# Altium project MCH_CLKB.PrjPcb (part 2 of 2)

## Sheet CLKB_clocking_fpga.SchDoc
size A3
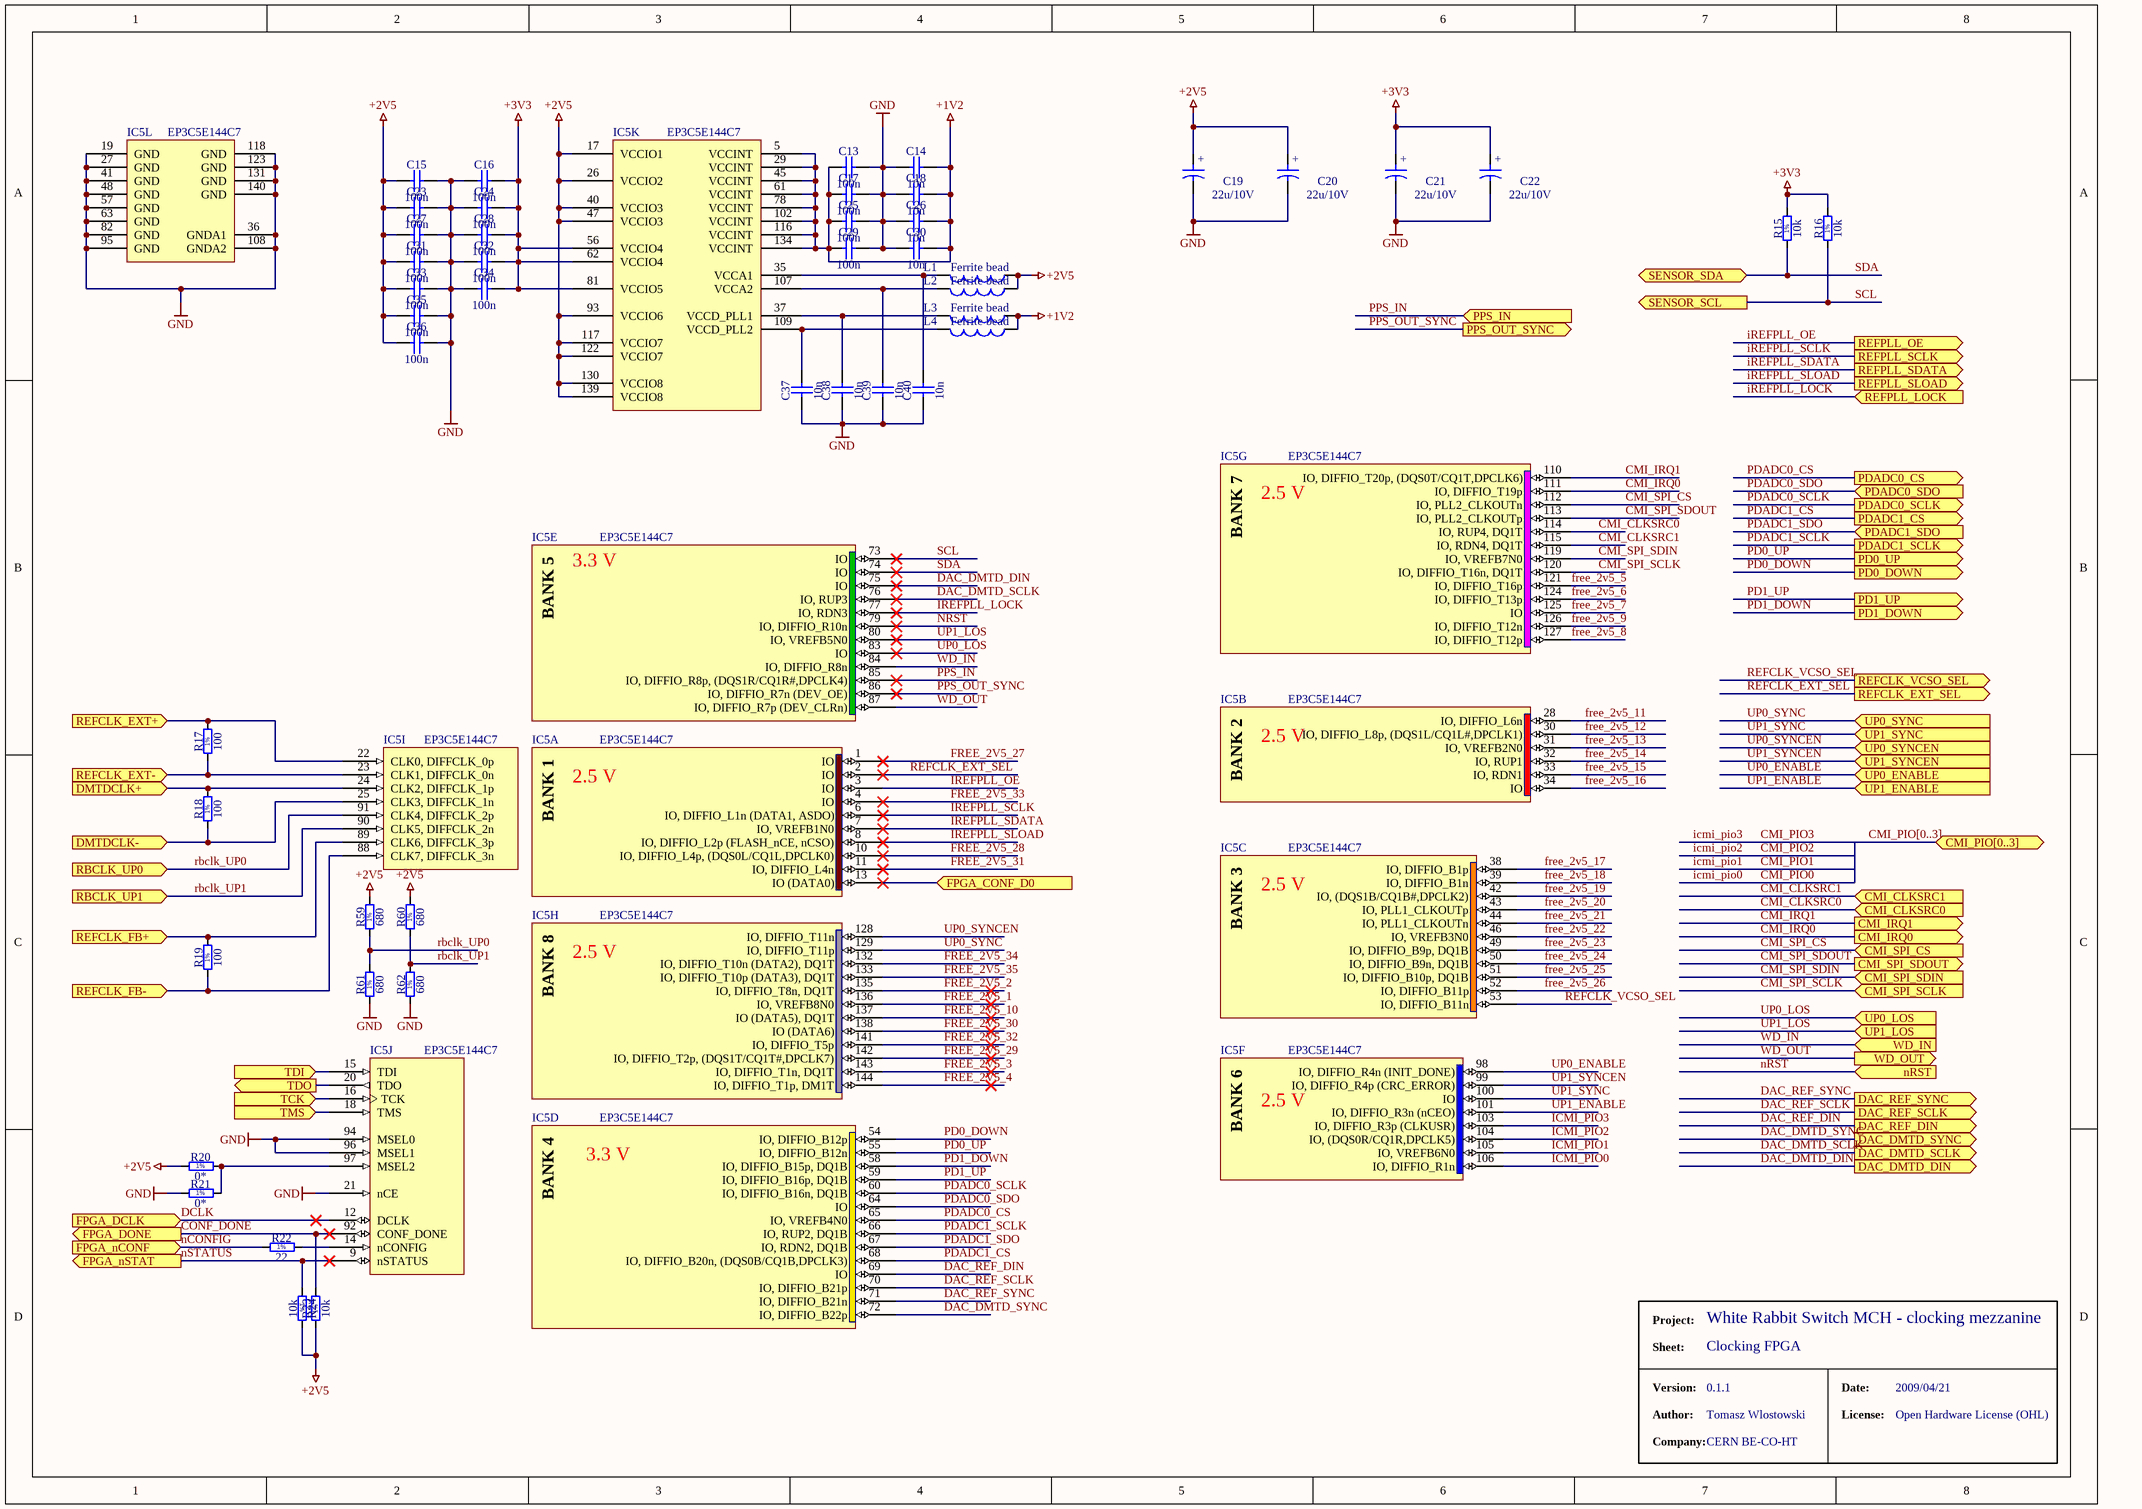
[diagram p4: CLKB_clocking_fpga.SchDoc]

### Parts
C13  100n  [CAPC1608X87N]
C14  10n  [CAPC1608X87N]
C15  100n  [CAPC1608X87N]
C16  100n  [CAPC1608X87N]
C17  100n  [CAPC1608X87N]
C18  10n  [CAPC1608X87N]
C19  22u/10V  [CAPMP3216X180N]
C20  22u/10V  [CAPMP3216X180N]
C21  22u/10V  [CAPMP3216X180N]
C22  22u/10V  [CAPMP3216X180N]
C23  100n  [CAPC1608X87N]
C24  100n  [CAPC1608X87N]
C25  100n  [CAPC1608X87N]
C26  10n  [CAPC1608X87N]
C27  100n  [CAPC1608X87N]
C28  100n  [CAPC1608X87N]
C29  100n  [CAPC1608X87N]
C30  10n  [CAPC1608X87N]
C31  100n  [CAPC1608X87N]
C32  100n  [CAPC1608X87N]
C33  100n  [CAPC1608X87N]
C34  100n  [CAPC1608X87N]
C35  100n  [CAPC1608X87N]
C36  100n  [CAPC1608X87N]
C37  10n  [CAPC1608X87N]
C38  10n  [CAPC1608X87N]
C39  10n  [CAPC1608X87N]
C40  10n  [CAPC1608X87N]
IC5  EP3C5E144C7  [EQFP144_N]  (parts A,B,C,D,E,F,G,H,I,J,K,L of 12)
L1  Ferrite bead  [L0603]
L2  Ferrite bead  [L0603]
L3  Ferrite bead  [L0603]
L4  Ferrite bead  [L0603]
R15  10k  [RESC1608X55N]
R16  10k  [RESC1608X55N]
R17  100  [RESC1608X55N]
R18  100  [RESC1608X55N]
R19  100  [RESC1608X55N]
R20  0*  [RESC1608X55N]
R21  0*  [RESC1608X55N]
R22  22  [RESC1608X55N]
R23  10k  [RESC1608X55N]
R24  10k  [RESC1608X55N]
R59  680  [RESC1608X55N]
R60  680  [RESC1608X55N]
R61  680  [RESC1608X55N]
R62  680  [RESC1608X55N]

### Ports
CMI_CLKSRC0 (in), CMI_CLKSRC1 (in), CMI_IRQ0 (out), CMI_IRQ1 (out), CMI_PIO[0..3] (bidir), CMI_SPI_CS (in), CMI_SPI_SCLK (in), CMI_SPI_SDIN (in), CMI_SPI_SDOUT (out), DAC_DMTD_DIN (out), DAC_DMTD_SCLK (out), DAC_DMTD_SYNC (out), DAC_REF_DIN (out), DAC_REF_SCLK (out), DAC_REF_SYNC (out), DMTDCLK+ (in), DMTDCLK- (in), FPGA_CONF_D0 (in), FPGA_DCLK (in), FPGA_DONE (out), FPGA_nCONF (in), FPGA_nSTAT (out), nRST (in), PD0_DOWN (out), PD0_UP (out), PD1_DOWN (out), PD1_UP (out), PDADC0_CS (out), PDADC0_SCLK (out), PDADC0_SDO (in), PDADC1_CS (out), PDADC1_SCLK (out), PDADC1_SDO (in), PPS_IN (in), PPS_OUT_SYNC (out), RBCLK_UP0 (in), RBCLK_UP1 (in), REFCLK_EXT+ (in), REFCLK_EXT- (in), REFCLK_EXT_SEL (out), REFCLK_FB+ (in), REFCLK_FB- (in), REFCLK_VCSO_SEL (out), REFPLL_LOCK (in), REFPLL_OE (out), REFPLL_SCLK (out), REFPLL_SDATA (out), REFPLL_SLOAD (out), SENSOR_SCL (out), SENSOR_SDA (bidir), TCK (in), TDI (in), TDO (out), TMS (in), UP0_ENABLE (in), UP0_LOS (in), UP0_SYNC (in), UP0_SYNCEN (in), UP1_ENABLE (in), UP1_LOS (in), UP1_SYNC (in), UP1_SYNCEN (in), WD_IN (in), WD_OUT (out)

### Nets
+1V2: C13.1 C14.2 C17.1 C18.2 C25.1 C26.2 C29.1 C30.2 IC5.5(VCCINT) IC5.29(VCCINT) IC5.45(VCCINT) IC5.61(VCCINT) IC5.78(VCCINT) IC5.102(VCCINT) IC5.116(VCCINT) IC5.134(VCCINT) L3.1 L4.1
+2V5: C15.1 C19.1 C20.1 C23.1 C27.1 C31.1 C33.1 C35.1 C36.1 IC5.17(VCCIO1) IC5.26(VCCIO2) IC5.40(VCCIO3) IC5.47(VCCIO3) IC5.93(VCCIO6) IC5.117(VCCIO7) IC5.122(VCCIO7) IC5.130(VCCIO8) IC5.139(VCCIO8) L1.1 L2.1 R20.1 R23.1 R24.2 R59.2 R60.2
+3V3: C16.2 C21.1 C22.1 C24.2 C28.2 C32.2 C34.2 IC5.56(VCCIO4) IC5.62(VCCIO4) IC5.81(VCCIO5) R15.2 R16.2
GND: C13.2 C14.1 C15.2 C16.1 C17.2 C18.1 C19.2 C20.2 C21.2 C22.2 C23.2 C24.1 C25.2 C26.1 C27.2 C28.1 C29.2 C30.1 C31.2 C32.1 C33.2 C34.1 C35.2 C36.2 C37.1 C38.1 C39.1 C40.1 IC5.19(GND) IC5.21(nCE) IC5.27(GND) IC5.36(GNDA1) IC5.41(GND) IC5.48(GND) IC5.57(GND) IC5.63(GND) IC5.82(GND) IC5.94(MSEL0) IC5.95(GND) IC5.96(MSEL1) IC5.108(GNDA2) IC5.118(GND) IC5.123(GND) IC5.131(GND) IC5.140(GND) R21.1 R61.1 R62.1
CMI_CLKSRC0: IC5.114(IO,_RUP4,_DQ1T) ; port CMI_CLKSRC0
CMI_CLKSRC1: IC5.115(IO,_RDN4,_DQ1T) ; port CMI_CLKSRC1
CMI_IRQ0: IC5.111(IO,_DIFFIO_T19p) ; port CMI_IRQ0
CMI_IRQ1: IC5.110(IO,_DIFFIO_T20p,_(DQS0T/CQ1T,DPCLK6)) ; port CMI_IRQ1
CMI_PIO0: IC5.106(IO,_DIFFIO_R1n)  [also labelled icmi_pio0]
CMI_PIO1: IC5.105(IO,_VREFB6N0)  [also labelled icmi_pio1]
CMI_PIO2: IC5.104(IO,_(DQS0R/CQ1R,DPCLK5))  [also labelled icmi_pio2]
CMI_PIO3: IC5.103(IO,_DIFFIO_R3p_(CLKUSR))  [also labelled icmi_pio3]
CMI_SPI_CS: IC5.112(IO,_PLL2_CLKOUTn) ; port CMI_SPI_CS
CMI_SPI_SCLK: IC5.120(IO,_DIFFIO_T16n,_DQ1T) ; port CMI_SPI_SCLK
CMI_SPI_SDIN: IC5.119(IO,_VREFB7N0) ; port CMI_SPI_SDIN
CMI_SPI_SDOUT: IC5.113(IO,_PLL2_CLKOUTp) ; port CMI_SPI_SDOUT
CONF_DONE: IC5.92(CONF_DONE) R23.2 ; port FPGA_DONE  [project net FPGA_DONE]
DAC_DMTD_DIN: IC5.75(IO) ; port DAC_DMTD_DIN
DAC_DMTD_SCLK: IC5.76(IO,_RUP3) ; port DAC_DMTD_SCLK
DAC_DMTD_SYNC: IC5.72(IO,_DIFFIO_B22p) ; port DAC_DMTD_SYNC
DAC_REF_DIN: IC5.69(IO) ; port DAC_REF_DIN
DAC_REF_SCLK: IC5.70(IO,_DIFFIO_B21p) ; port DAC_REF_SCLK
DAC_REF_SYNC: IC5.71(IO,_DIFFIO_B21n) ; port DAC_REF_SYNC
DCLK: IC5.12(DCLK) ; port FPGA_DCLK  [project net FPGA_DCLK]
DMTDCLK+: IC5.24(CLK2,_DIFFCLK_1p) R18.2 ; port DMTDCLK+
DMTDCLK-: IC5.25(CLK3,_DIFFCLK_1n) R18.1 ; port DMTDCLK-
FPGA_CONF_D0: IC5.13(IO_(DATA0)) ; port FPGA_CONF_D0
FREE_2V5_1: IC5.136(IO,_VREFB8N0)
FREE_2V5_2: IC5.135(IO,_DIFFIO_T8n,_DQ1T)
FREE_2V5_3: IC5.143(IO,_DIFFIO_T1n,_DQ1T)
FREE_2V5_4: IC5.144(IO,_DIFFIO_T1p,_DM1T)
free_2v5_5: IC5.121(IO,_DIFFIO_T16p)
free_2v5_6: IC5.124(IO,_DIFFIO_T13p)
free_2v5_7: IC5.125(IO)
free_2v5_8: IC5.127(IO,_DIFFIO_T12p)
free_2v5_9: IC5.126(IO,_DIFFIO_T12n)
FREE_2V5_10: IC5.137(IO_(DATA5),_DQ1T)
free_2v5_11: IC5.28(IO,_DIFFIO_L6n)
free_2v5_12: IC5.30(IO,_DIFFIO_L8p,_(DQS1L/CQ1L#,DPCLK1))
free_2v5_13: IC5.31(IO,_VREFB2N0)
free_2v5_14: IC5.32(IO,_RUP1)
free_2v5_15: IC5.33(IO,_RDN1)
free_2v5_16: IC5.34(IO)
free_2v5_17: IC5.38(IO,_DIFFIO_B1p)
free_2v5_18: IC5.39(IO,_DIFFIO_B1n)
free_2v5_19: IC5.42(IO,_(DQS1B/CQ1B#,DPCLK2))
free_2v5_20: IC5.43(IO,_PLL1_CLKOUTp)
free_2v5_21: IC5.44(IO,_PLL1_CLKOUTn)
free_2v5_22: IC5.46(IO,_VREFB3N0)
free_2v5_23: IC5.49(IO,_DIFFIO_B9p,_DQ1B)
free_2v5_24: IC5.50(IO,_DIFFIO_B9n,_DQ1B)
free_2v5_25: IC5.51(IO,_DIFFIO_B10p,_DQ1B)
free_2v5_26: IC5.52(IO,_DIFFIO_B11p)
FREE_2V5_27: IC5.1(IO)
FREE_2V5_28: IC5.10(IO,_DIFFIO_L4p,_(DQS0L/CQ1L,DPCLK0))
FREE_2V5_29: IC5.142(IO,_DIFFIO_T2p,_(DQS1T/CQ1T#,DPCLK7))
FREE_2V5_30: IC5.138(IO_(DATA6))
FREE_2V5_31: IC5.11(IO,_DIFFIO_L4n)
FREE_2V5_32: IC5.141(IO,_DIFFIO_T5p)
FREE_2V5_33: IC5.4(IO)
FREE_2V5_34: IC5.132(IO,_DIFFIO_T10n_(DATA2),_DQ1T)
FREE_2V5_35: IC5.133(IO,_DIFFIO_T10p_(DATA3),_DQ1T)
iREFPLL_LOCK: IC5.77(IO,_RDN3) ; port REFPLL_LOCK  [project net EXTPLL_LOCK]
iREFPLL_OE: IC5.3(IO) ; port REFPLL_OE  [project net EXTPLL_OE]
iREFPLL_SCLK: IC5.6(IO,_DIFFIO_L1n_(DATA1,_ASDO)) ; port REFPLL_SCLK  [project net EXTPLL_SCLK]
iREFPLL_SDATA: IC5.7(IO,_VREFB1N0) ; port REFPLL_SDATA  [project net EXTPLL_SDATA]
iREFPLL_SLOAD: IC5.8(IO,_DIFFIO_L2p_(FLASH_nCE,_nCSO)) ; port REFPLL_SLOAD  [project net EXTPLL_SLOAD]
JTAG_TCK: IC5.16(TCK) ; port TCK
JTAG_TDI: IC5.15(TDI) ; port TDI
JTAG_TMS: IC5.18(TMS) ; port TMS
nCONFIG: R22.1 ; port FPGA_nCONF  [project net FPGA_nCONF]
nRST: IC5.79(IO,_DIFFIO_R10n) ; port nRST
nSTATUS: IC5.9(nSTATUS) R24.1 ; port FPGA_nSTAT  [project net FPGA_nSTAT]
PD0_DOWN: IC5.54(IO,_DIFFIO_B12p) ; port PD0_DOWN
PD0_UP: IC5.55(IO,_DIFFIO_B12n) ; port PD0_UP
PD1_DOWN: IC5.58(IO,_DIFFIO_B15p,_DQ1B) ; port PD1_DOWN
PD1_UP: IC5.59(IO,_DIFFIO_B16p,_DQ1B) ; port PD1_UP
PDADC0_CS: IC5.65(IO,_VREFB4N0) ; port PDADC0_CS
PDADC0_SCLK: IC5.60(IO,_DIFFIO_B16n,_DQ1B) ; port PDADC0_SCLK
PDADC0_SDO: IC5.64(IO) ; port PDADC0_SDO
PDADC1_CS: IC5.68(IO,_DIFFIO_B20n,_(DQS0B/CQ1B,DPCLK3)) ; port PDADC1_CS
PDADC1_SCLK: IC5.66(IO,_RUP2,_DQ1B) ; port PDADC1_SCLK
PDADC1_SDO: IC5.67(IO,_RDN2,_DQ1B) ; port PDADC1_SDO
PPS_IN: IC5.85(IO,_DIFFIO_R8p,_(DQS1R/CQ1R#,DPCLK4)) ; port PPS_IN  [project net PPS_IN_EXT]
PPS_OUT_SYNC: IC5.86(IO,_DIFFIO_R7n_(DEV_OE)) ; port PPS_OUT_SYNC
rbclk_UP0: IC5.91(CLK4,_DIFFCLK_2p) R59.1 R61.2 ; port RBCLK_UP0  [project net UP0_RBCLK]
rbclk_UP1: IC5.90(CLK5,_DIFFCLK_2n) R60.1 R62.2 ; port RBCLK_UP1  [project net UP1_RBCLK]
REFCLK_EXT_FB+: IC5.22(CLK0,_DIFFCLK_0p) R17.2 ; port REFCLK_EXT+
REFCLK_EXT_FB-: IC5.23(CLK1,_DIFFCLK_0n) R17.1 ; port REFCLK_EXT-
REFCLK_EXT_SEL: IC5.2(IO) ; port REFCLK_EXT_SEL
REFCLK_FB+: IC5.88(CLK7,_DIFFCLK_3n) R19.1 ; port REFCLK_FB-
REFCLK_FB-: IC5.89(CLK6,_DIFFCLK_3p) R19.2 ; port REFCLK_FB+
REFCLK_VCSO_SEL: IC5.53(IO,_DIFFIO_B11n) ; port REFCLK_VCSO_SEL
SCL: IC5.73(IO) R16.1 ; port SENSOR_SCL
SDA: IC5.74(IO) R15.1 ; port SENSOR_SDA
TDO: IC5.20(TDO) ; port TDO
UP0_ENABLE: IC5.98(IO,_DIFFIO_R4n_(INIT_DONE)) ; port UP0_ENABLE
UP0_LOS: IC5.83(IO) ; port UP0_LOS
UP0_SYNC: IC5.129(IO,_DIFFIO_T11p) ; port UP0_SYNC
UP0_SYNCEN: IC5.128(IO,_DIFFIO_T11n) ; port UP0_SYNCEN
UP1_ENABLE: IC5.101(IO,_DIFFIO_R3n_(nCEO)) ; port UP1_ENABLE
UP1_LOS: IC5.80(IO,_VREFB5N0) ; port UP1_LOS
UP1_SYNC: IC5.100(IO) ; port UP1_SYNC
UP1_SYNCEN: IC5.99(IO,_DIFFIO_R4p_(CRC_ERROR)) ; port UP1_SYNCEN
WD_IN: IC5.84(IO,_DIFFIO_R8n) ; port WD_IN
WD_OUT: IC5.87(IO,_DIFFIO_R7p_(DEV_CLRn)) ; port WD_OUT
NetC37_2: C37.2 IC5.109(VCCD_PLL2) L4.2
NetC38_2: C38.2 IC5.37(VCCD_PLL1) L3.2
NetC39_2: C39.2 IC5.107(VCCA2) L2.2
NetC40_2: C40.2 IC5.35(VCCA1) L1.2
NetIC5_14: IC5.14(nCONFIG) R22.2
NetIC5_97: IC5.97(MSEL2) R20.2 R21.2

### Buses and harness runs
bus CMI_PIO[0..3] = port CMI_PIO[0..3]

### Notes on the sheet
- 2.5 V
- 3.3 V
- Project:
- White Rabbit Switch MCH - clocking mezzanine
- Sheet:
- Version:
- Clocking FPGA
- 0.1.1
- Date:
- 2009/04/21
- Author:
- Company:
- Tomasz Wlostowski
- CERN BE-CO-HT
- License:
- Open Hardware License (OHL)
- (in symbol CTE3216-18_22UF_10V_10%) +
- (in symbol EP3C5E144C7, part A) BANK 1
- (in symbol EP3C5E144C7, part B) BANK 2
- (in symbol EP3C5E144C7, part C) BANK 3
- (in symbol EP3C5E144C7, part D) BANK 4
- (in symbol EP3C5E144C7, part E) BANK 5
- (in symbol EP3C5E144C7, part F) BANK 6
- (in symbol EP3C5E144C7, part G) BANK 7
- (in symbol EP3C5E144C7, part H) BANK 8
- (in symbol R0603_0R_JUMPER) 1%
- (in symbol R0603_10K_1%_0.1W_100PPM) 1%
- (in symbol R0603_22R_1%_0.1W_100PPM) 1%
- (in symbol R0603_100R_1%_0.1W_100PPM) 1%
- (in symbol R0603_680R_1%_0.1W_100PPM) 1%

### Library data of the parts
C13 C15-C17 C23-C25 C27-C29 C31-C36 = CC0603_100NF_50V_10%_X7R: Non-polarised capacitor; Part Description: SMD Multilayer Chip Ceramic Capacitor; Manufacturer: GENERIC; Manufacturer1 Part Number: 223858615649; Manufacturer1 Datasheet: \\cern.ch\dfs\Applications\Altium\Datasheets\CC0603_X7R_PHYCOMP.pdf; Value: 100nF; Voltage: 50V; TC: X7R; Tolerance: ±10%; Table: Capacitors SMD; Part Number: CC0603_100NF_50V_10%_X7R; Component Kind: Standard; Component Type: Standard; Designator: Capacitor - non polarized; Library Reference: Capacitor - non polarized; Pin Count: 2; Status: Preferred; Manufacturer Part Number: CC0603_100NF_50V_10%_X7R; Case: 0603; Mounted: Yes; Socket: No; SMD: Yes; Manufacturer1 Example: PHYCOMP; Manufacturer1 ComponentHeight: 0.87mm; HelpURL: \\cern.ch\dfs\Applications\Altium\Datasheets\CC0603_X7R_PHYCOMP.pdf; Author: CERN DEM JLC; CreateDate: 12/3/2007; LatestRevisionDate: 12/3/2007
C14 C18 C26 C30 C37-C40 = CC0603_10NF_50V_10%_X7R: Non-polarised capacitor; Part Description: SMD Multilayer Chip Ceramic Capacitor; Manufacturer: GENERIC; Manufacturer1 Part Number: 223858615636; Manufacturer1 Datasheet: \\cern.ch\dfs\Applications\Altium\Datasheets\CC0603_X7R_PHYCOMP.pdf; Value: 10nF; Voltage: 50V; TC: X7R; Tolerance: ±10%; Table: Capacitors SMD; Part Number: CC0603_10NF_50V_10%_X7R; Component Kind: Standard; Component Type: Standard; Designator: Capacitor - non polarized; Library Reference: Capacitor - non polarized; Pin Count: 2; Status: Preferred; Manufacturer Part Number: CC0603_10NF_50V_10%_X7R; Case: 0603; Mounted: Yes; Socket: No; SMD: Yes; Manufacturer1 Example: PHYCOMP; Manufacturer1 ComponentHeight: 0.87mm; HelpURL: \\cern.ch\dfs\Applications\Altium\Datasheets\CC0603_X7R_PHYCOMP.pdf; Author: CERN DEM JLC; CreateDate: 12/3/2007; LatestRevisionDate: 12/3/2007
C19-C22 = CTE3216-18_22UF_10V_10%: Polarised capacitor; Part Description: Solid Tantalum Chip Capacitor; Manufacturer: GENERIC; Manufacturer1 Part Number: TAJA226K010R; Manufacturer1 Datasheet: \\cern.ch\dfs\Applications\Altium\Datasheets\CTE_AVX_TAJ.pdf; Value: 22uF; Voltage: 10V; Tolerance: ±10%; Table: Capacitors SMD; Part Number: CTE3216-18_22UF_10V_10%; Component Kind: Standard; Component Type: Standard; Designator: Capacitor - polarized; Library Reference: Capacitor - polarized; Pin Count: 2; Status: Preferred; Manufacturer Part Number: CTE3216-18_22UF_10V_10%; Case: A; Mounted: Yes; Socket: No; SMD: Yes; Manufacturer1 Example: AVX; Manufacturer1 ComponentHeight: 1.8mm; HelpURL: \\cern.ch\dfs\Applications\Altium\Datasheets\CTE_AVX_TAJ.pdf; Author: CERN DEM JLC; CreateDate: 12/3/2007; LatestRevisionDate: 12/3/2007
IC5 = EP3C5E144C7: Cyclone III Family FPGA, 94 I/O Pins, 4 PLLs, 144-Pin EQFP, Speed Grade 7, Commercial Grade; Note: Exposed pad at the bottom of this package must be connected to PCB GND.; RefId: 1635055; Published: 14-Mar-2008; DatasheetVersion: ver1.2, Sep-2007; PackageVersion: ver14.8, Oct-2007; PackageReference: EQFP144; Publisher: Altium Limited; PackageDescription: 144-Pin Plastic Enhanced Quad Flat Pack (EQFP144) - Wire Bond; Code_JEDEC: MS-026-BFB; ComponentLink1Description: Manufacturer Link; ComponentLink1URL: http://www.altera.com/; ComponentLink2Description: Handbook (7.86MB); ComponentLink2URL: http://www.altera.com/literature/hb/cyc3/cyclone3_handbook.pdf; ComponentLink3Description: Packaging Specification; ComponentLink3URL: http://www.altera.com/literature/ds/dspkg.pdf; Supplier: Farnell
L1-L4 = Inductor: Code_IEC: 1005; Published: 8-Jun-2000; LatestRevisionDate: 17-Jul-2002; LatestRevisionNote: Re-released for DXP Platform.; PackageReference: 0402-A; Publisher: Altium Limited; Code_JEITA: 0402
R15 R16 R23 R24 = R0603_10K_1%_0.1W_100PPM: Resistor - 1%; Part Description: General Purpose Thick Film Chip Resistor; Manufacturer: GENERIC; Manufacturer1 Part Number: NRC06F1002TRF; Manufacturer1 Datasheet: \\cern.ch\dfs\Applications\Altium\Datasheets\R0603_NIC_NRC.pdf; Power: 0.1W; TC: ±100ppm/°C; Table: Resistors SMD; Part Number: R0603_10K_1%_0.1W_100PPM; Component Kind: Standard; Component Type: Standard; Designator: Resistor - 1%; Library Reference: Resistor - 1%; Pin Count: 2; Value: 10k; Status: Preferred; Tolerance: ±1%; Manufacturer Part Number: R0603_10K_1%_0.1W_100PPM; Case: 0603; Mounted: Yes; Socket: No; SMD: Yes; Manufacturer1 Example: NIC COMPONENT; Manufacturer1 ComponentHeight: 0.55mm; HelpURL: \\cern.ch\dfs\Applications\Altium\Datasheets\R0603_NIC_NRC.pdf; Author: CERN DEM JLC; CreateDate: 12/3/2007; LatestRevisionDate: 3/13/2008
R17-R19 = R0603_100R_1%_0.1W_100PPM: Resistor - 1%; Part Description: General Purpose Thick Film Chip Resistor; Manufacturer: GENERIC; Manufacturer1 Part Number: NRC06F4700TRF; Manufacturer1 Datasheet: \\cern.ch\dfs\Applications\Altium\Datasheets\R0603_NIC_NRC.pdf; Power: 0.1W; TC: ±100ppm/°C; Table: Resistors SMD; Part Number: R0603_100R_1%_0.1W_100PPM; Component Kind: Standard; Component Type: Standard; Designator: Resistor - 1%; Library Reference: Resistor - 1%; Pin Count: 2; Value: 100; Status: Preferred; Tolerance: ±1%; Manufacturer Part Number: R0603_100R_1%_0.1W_100PPM; Case: 0603; Mounted: Yes; Socket: No; SMD: Yes; Manufacturer1 Example: NIC COMPONENT; Manufacturer1 ComponentHeight: 0.55mm; HelpURL: \\cern.ch\dfs\Applications\Altium\Datasheets\R0603_NIC_NRC.pdf; Author: CERN DEM JLC; CreateDate: 12/3/2007; LatestRevisionDate: 3/13/2008
R20 R21 = R0603_0R_JUMPER: Resistor - 1%; Part Description: 1A (0.05R Max DC Resistance) Zero Ohm Jumper; Manufacturer: GENERIC; Manufacturer1 Part Number: NRC06Z0; Manufacturer1 Datasheet: \\cern.ch\dfs\Applications\Altium\Datasheets\R0603_NIC_NRC.pdf; Value: 0; Table: Resistors SMD; Part Number: R0603_0R_JUMPER; Component Kind: Standard; Component Type: Standard; Designator: Resistor - 1%; Library Reference: Resistor - 1%; Pin Count: 2; Status: Preferred; Manufacturer Part Number: R0603_0R_JUMPER; Case: 0603; Mounted: Yes; Socket: No; SMD: Yes; Manufacturer1 Example: NIC COMPONENT; Manufacturer1 ComponentHeight: 0.55mm; HelpURL: \\cern.ch\dfs\Applications\Altium\Datasheets\R0603_NIC_NRC.pdf; Author: CERN DEM JLC; CreateDate: 12/3/2007; LatestRevisionDate: 3/13/2008
R22 = R0603_22R_1%_0.1W_100PPM: Resistor - 1%; Part Description: General Purpose Thick Film Chip Resistor; Manufacturer: GENERIC; Manufacturer1 Part Number: NRC06F22R0TRF; Manufacturer1 Datasheet: \\cern.ch\dfs\Applications\Altium\Datasheets\R0603_NIC_NRC.pdf; Power: 0.1W; TC: ±100ppm/°C; Table: Resistors SMD; Part Number: R0603_22R_1%_0.1W_100PPM; Component Kind: Standard; Component Type: Standard; Designator: Resistor - 1%; Library Reference: Resistor - 1%; Pin Count: 2; Value: 22; Status: Preferred; Tolerance: ±1%; Manufacturer Part Number: R0603_22R_1%_0.1W_100PPM; Case: 0603; Mounted: Yes; Socket: No; SMD: Yes; Manufacturer1 Example: NIC COMPONENT; Manufacturer1 ComponentHeight: 0.55mm; HelpURL: \\cern.ch\dfs\Applications\Altium\Datasheets\R0603_NIC_NRC.pdf; Author: CERN DEM JLC; CreateDate: 12/3/2007; LatestRevisionDate: 3/13/2008
R59-R62 = R0603_680R_1%_0.1W_100PPM: Resistor - 1%; Part Description: General Purpose Thick Film Chip Resistor; Manufacturer: GENERIC; Manufacturer1 Part Number: NRC06F6800TRF; Manufacturer1 Datasheet: \\cern.ch\dfs\Applications\Altium\Datasheets\R0603_NIC_NRC.pdf; Power: 0.1W; TC: ±100ppm/°C; Table: Resistors SMD; Part Number: R0603_680R_1%_0.1W_100PPM; Component Kind: Standard; Component Type: Standard; Designator: Resistor - 1%; Library Reference: Resistor - 1%; Pin Count: 2; Value: 680; Status: Preferred; Tolerance: ±1%; Manufacturer Part Number: R0603_680R_1%_0.1W_100PPM; Case: 0603; Mounted: Yes; Socket: No; SMD: Yes; Manufacturer1 Example: NIC COMPONENT; Manufacturer1 ComponentHeight: 0.55mm; HelpURL: \\cern.ch\dfs\Applications\Altium\Datasheets\R0603_NIC_NRC.pdf; Author: CERN DEM JLC; CreateDate: 12/3/2007; LatestRevisionDate: 3/13/2008

## Sheet CLKB_RS232_port.SchDoc
size A
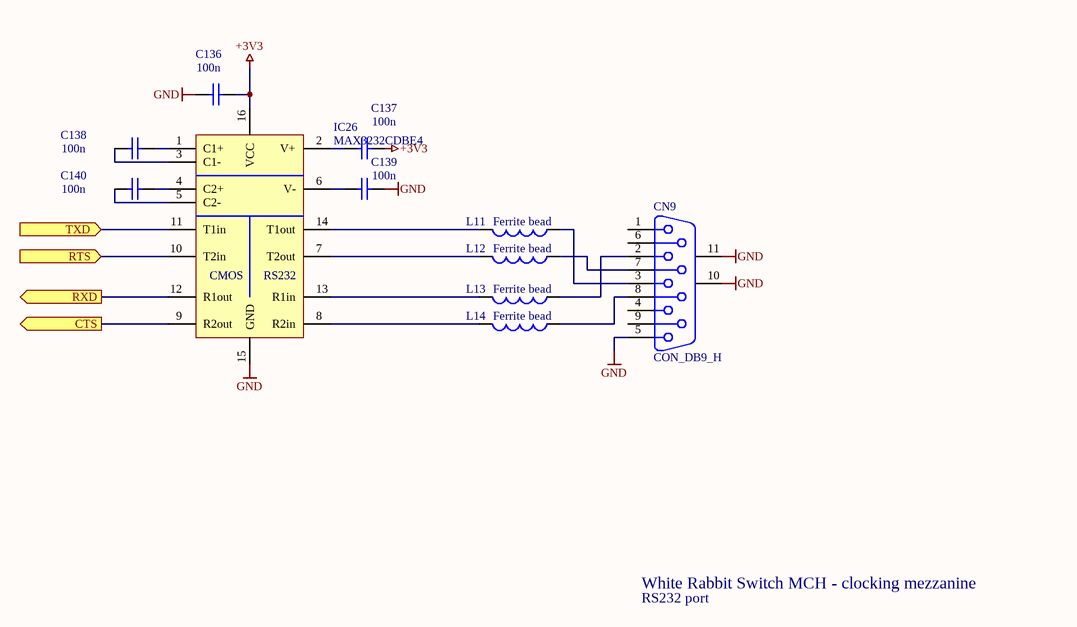
[diagram p5: CLKB_RS232_port.SchDoc]

### Parts
C136  100n  [CAPC1608X87N]
C137  100n  [CAPC1608X87N]
C138  100n  [CAPC1608X87N]
C139  100n  [CAPC1608X87N]
C140  100n  [CAPC1608X87N]
CN9  CON_DB9_H  [DSUB_MINI_9]
IC26  MAX3232CDBE4  [SSOP16]
L11  Ferrite bead  [L0603]
L12  Ferrite bead  [L0603]
L13  Ferrite bead  [L0603]
L14  Ferrite bead  [L0603]

### Ports
CTS (out), RTS (in), RXD (out), TXD (in)

### Nets
+3V3: C136.2 C137.2 IC26.16(VCC)
GND: C136.1 C139.2 CN9.5 CN9.10(MH1) CN9.11(MH2) IC26.15(GND)
RS_CTS: IC26.9(R2out) ; port CTS
RS_RTS: IC26.10(T2in) ; port RTS
RS_RXD: IC26.12(R1out) ; port RXD
RS_TXD: IC26.11(T1in) ; port TXD
NetC137_1: C137.1 IC26.2(V+)
NetC138_1: C138.1 IC26.3(C1-)
NetC138_2: C138.2 IC26.1(C1+)
NetC139_1: C139.1 IC26.6(V-)
NetC140_1: C140.1 IC26.5(C2-)
NetC140_2: C140.2 IC26.4(C2+)
NetCN9_2: CN9.2 L13.1
NetCN9_3: CN9.3 L11.1
NetCN9_7: CN9.7 L12.1
NetCN9_8: CN9.8 L14.1
NetIC26_7: IC26.7(T2out) L12.2
NetIC26_8: IC26.8(R2in) L14.2
NetIC26_13: IC26.13(R1in) L13.2
NetIC26_14: IC26.14(T1out) L11.2

Not connected (* = marked no-connect by the designer): CN9 1 4 6 9

### Notes on the sheet
- White Rabbit Switch MCH - clocking mezzanine
- RS232 port
- (in symbol IFC_MAX3232) CMOS; RS232

### Library data of the parts
C136-C140 = CC0603_100NF_50V_10%_X7R: as C13 on sheet CLKB_clocking_fpga; Part Number: CC0603_100NF_50V_10%_X7R; Component Kind: Standard; Component Type: Standard; Designator: Capacitor - non polarized; Library Reference: Capacitor - non polarized; Pin Count: 2; Status: Preferred; Manufacturer Part Number: CC0603_100NF_50V_10%_X7R; Case: 0603; Mounted: Yes; Socket: No; SMD: Yes; Manufacturer1 Example: PHYCOMP; Manufacturer1 ComponentHeight: 0.87mm; HelpURL: \\cern.ch\dfs\Applications\Altium\Datasheets\CC0603_X7R_PHYCOMP.pdf; Author: CERN DEM JLC; CreateDate: 12/3/2007; LatestRevisionDate: 12/3/2007
CN9 = CON_DB9_H: Receptacle Assembly, 9 Position, Right Angle; Manufacturer: Generic Components; Package Information: Latest Revision: O; Class I: Connector; Positions: 9; RefId: 1263551; Value: MOLEX - 0836119006; Published: 15-Jun-2001; Revision: July-2002: Re-released for DXP Platform.; Datasheet: (1-Sep-1999); Package Reference: 788750; Publisher: Altium Limited; Orientation: Right Angle; Gender: Receptacle; Supplier: Farnell
IC26 = IFC_MAX3232: RefId: 1287435; Supplier: Farnell; Value: MAX3232CDBE4
L11-L14 = Inductor: Code_IEC: 1005; Published: 8-Jun-2000; LatestRevisionDate: 17-Jul-2002; LatestRevisionNote: Re-released for DXP Platform.; PackageReference: 0402-A; Publisher: Altium Limited; Code_JEITA: 0402

## Sheet CLKB_temp_sensors.SchDoc
size A
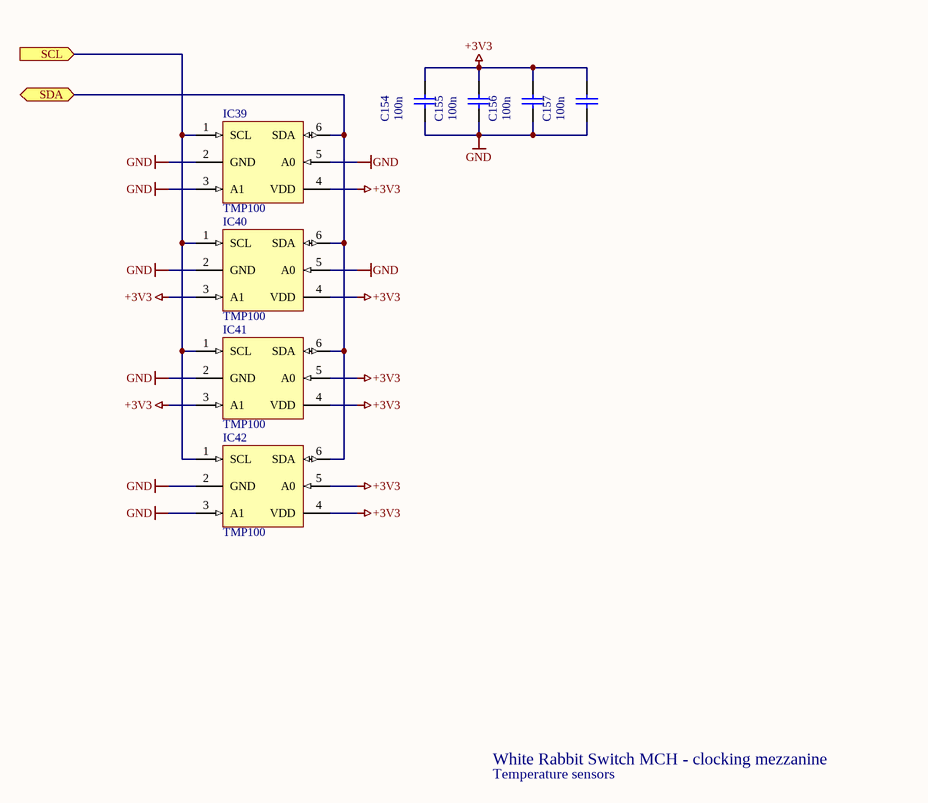
[diagram p6: CLKB_temp_sensors.SchDoc]

### Parts
C154  100n  [CAPC1608X87N]
C155  100n  [CAPC1608X87N]
C156  100n  [CAPC1608X87N]
C157  100n  [CAPC1608X87N]
IC39  TMP100  [SOT23A-6L]
IC40  TMP100  [SOT23A-6L]
IC41  TMP100  [SOT23A-6L]
IC42  TMP100  [SOT23A-6L]

### Ports
SCL (in), SDA (bidir)

### Nets
+3V3: C154.2 C155.2 C156.2 C157.2 IC39.4(VDD) IC40.3(A1) IC40.4(VDD) IC41.3(A1) IC41.4(VDD) IC41.5(A0) IC42.4(VDD) IC42.5(A0)
GND: C154.1 C155.1 C156.1 C157.1 IC39.2(GND) IC39.3(A1) IC39.5(A0) IC40.2(GND) IC40.5(A0) IC41.2(GND) IC42.2(GND) IC42.3(A1)
SCL: IC39.1(SCL) IC40.1(SCL) IC41.1(SCL) IC42.1(SCL) ; port SCL
SDA: IC39.6(SDA) IC40.6(SDA) IC41.6(SDA) IC42.6(SDA) ; port SDA

### Notes on the sheet
- White Rabbit Switch MCH - clocking mezzanine
- Temperature sensors

### Library data of the parts
C154-C157 = CC0603_100NF_50V_10%_X7R: as C13 on sheet CLKB_clocking_fpga; Part Number: CC0603_100NF_50V_10%_X7R; Component Kind: Standard; Component Type: Standard; Designator: Capacitor - non polarized; Library Reference: Capacitor - non polarized; Pin Count: 2; Status: Preferred; Manufacturer Part Number: CC0603_100NF_50V_10%_X7R; Case: 0603; Mounted: Yes; Socket: No; SMD: Yes; Manufacturer1 Example: PHYCOMP; Manufacturer1 ComponentHeight: 0.87mm; HelpURL: \\cern.ch\dfs\Applications\Altium\Datasheets\CC0603_X7R_PHYCOMP.pdf; Author: CERN DEM JLC; CreateDate: 12/3/2007; LatestRevisionDate: 12/3/2007
IC39-IC42 = TMP100: I2C temp. sensor; RefId: 296-12750-1-ND; Value: TMP101NA/250; Supplier: Digikey

## Nets that join several sheets
+1V2: CLKB_power_regulators (6 pins), CLKB_clocking_fpga (18 pins)
+2V5: CLKB_main (CN1.9 CN1.10 CN1.11 CN1.12), CLKB_clocking_system (43 pins), CLKB_power_regulators (C111.1 C119.1 IC22.3), CLKB_clocking_fpga (25 pins)
+3V3: CLKB_main (CN1.5 CN1.6 CN1.7 CN1.8), CLKB_analog_phase_detector (10 pins), CLKB_clocking_system (21 pins), CLKB_power_regulators (C116.1 D5.1), CLKB_clocking_fpga (12 pins), CLKB_RS232_port (C136.2 C137.2 IC26.16), CLKB_temp_sensors (12 pins)
+3V3_OSC: CLKB_clocking_system (6 pins), CLKB_power_regulators (C106.2 C107.2 C109.1 IC21.4)
+5V: CLKB_clocking_system (IC17.2), CLKB_power_regulators (7 pins)
+12V_BULK: CLKB_main (CN1.1 CN1.2 CN1.3 CN1.4), CLKB_power_regulators (C103.1 IC20.3)
GND: CLKB_main (43 pins), CLKB_analog_phase_detector (16 pins), CLKB_clocking_system (90 pins), CLKB_power_regulators (20 pins), CLKB_clocking_fpga (48 pins), CLKB_RS232_port (6 pins), CLKB_temp_sensors (12 pins)
CMI_CLKSRC0: CLKB_main (CN13.19), CLKB_clocking_fpga (IC5.114)
CMI_CLKSRC1: CLKB_main (CN13.17), CLKB_clocking_fpga (IC5.115)
CMI_IRQ0: CLKB_main (CN13.23), CLKB_clocking_fpga (IC5.111)
CMI_IRQ1: CLKB_main (CN13.21), CLKB_clocking_fpga (IC5.110)
CMI_PIO0: CLKB_main (CN13.13), CLKB_clocking_fpga (IC5.106)
CMI_PIO1: CLKB_main (CN13.11), CLKB_clocking_fpga (IC5.105)
CMI_PIO2: CLKB_main (CN13.9), CLKB_clocking_fpga (IC5.104)
CMI_PIO3: CLKB_main (CN13.7), CLKB_clocking_fpga (IC5.103)
CMI_SPI_CS: CLKB_main (CN13.27), CLKB_clocking_fpga (IC5.112)
CMI_SPI_SCLK: CLKB_main (CN13.33), CLKB_clocking_fpga (IC5.120)
CMI_SPI_SDIN: CLKB_main (CN13.31), CLKB_clocking_fpga (IC5.119)
CMI_SPI_SDOUT: CLKB_main (CN13.29), CLKB_clocking_fpga (IC5.113)
DAC_DMTD_DIN: CLKB_clocking_system (IC18.7), CLKB_clocking_fpga (IC5.75)
DAC_DMTD_SCLK: CLKB_clocking_system (IC18.6), CLKB_clocking_fpga (IC5.76)
DAC_DMTD_SYNC: CLKB_clocking_system (IC18.5), CLKB_clocking_fpga (IC5.72)
DAC_REF_DIN: CLKB_clocking_system (IC15.7), CLKB_clocking_fpga (IC5.69)
DAC_REF_SCLK: CLKB_clocking_system (IC15.6), CLKB_clocking_fpga (IC5.70)
DAC_REF_SYNC: CLKB_clocking_system (IC15.5), CLKB_clocking_fpga (IC5.71)
DMTDCLK+: CLKB_clocking_system (IC11.11), CLKB_clocking_fpga (IC5.24 R18.2)
DMTDCLK-: CLKB_clocking_system (IC11.12), CLKB_clocking_fpga (IC5.25 R18.1)
DMTDCLK_MAIN+: CLKB_main (CN3.9), CLKB_clocking_system (IC11.8)
DMTDCLK_MAIN-: CLKB_main (CN3.11), CLKB_clocking_system (IC11.7)
EXTPLL_LOCK: CLKB_clocking_system (IC9.20), CLKB_clocking_fpga (IC5.77)
EXTPLL_OE: CLKB_clocking_system (IC9.21), CLKB_clocking_fpga (IC5.3)
EXTPLL_SCLK: CLKB_clocking_system (IC9.17), CLKB_clocking_fpga (IC5.6)
EXTPLL_SDATA: CLKB_clocking_system (IC9.16), CLKB_clocking_fpga (IC5.7)
EXTPLL_SLOAD: CLKB_clocking_system (IC9.15), CLKB_clocking_fpga (IC5.8)
EXTPPSIN: CLKB_main (CN4.1), CLKB_clocking_system (IC8.2 R30.2)
EXTPPSOUT: CLKB_main (CN2.1), CLKB_clocking_system (R32.1)
EXTREFIN_10M: CLKB_main (CN6.1), CLKB_clocking_system (C60.1 R33.2 R34.2)
EXTREFIN_125M: CLKB_main (CN5.1), CLKB_clocking_system (C78.1 R41.2 R42.2)
EXTREFOUT: CLKB_main (CN7.1), CLKB_clocking_system (R46.1)
FPGA_CONF_D0: CLKB_main (CN1.23), CLKB_clocking_fpga (IC5.13)
FPGA_DCLK: CLKB_main (CN1.25), CLKB_clocking_fpga (IC5.12)
FPGA_DONE: CLKB_main (CN1.27), CLKB_clocking_fpga (IC5.92 R23.2)
FPGA_nCONF: CLKB_main (CN1.29), CLKB_clocking_fpga (R22.1)
FPGA_nSTAT: CLKB_main (CN1.31), CLKB_clocking_fpga (IC5.9 R24.1)
JTAG_TCK: CLKB_main (CN1.17), CLKB_clocking_fpga (IC5.16)
JTAG_TDI: CLKB_main (CN1.13), CLKB_clocking_fpga (IC5.15)
JTAG_TMS: CLKB_main (CN1.19), CLKB_clocking_fpga (IC5.18)
nRST: CLKB_main (CN13.41), CLKB_clocking_fpga (IC5.79)
PD0_DOWN: CLKB_analog_phase_detector (D1.2 R7.1), CLKB_clocking_fpga (IC5.54)
PD0_UP: CLKB_analog_phase_detector (D1.1 R1.2), CLKB_clocking_fpga (IC5.55)
PD1_DOWN: CLKB_analog_phase_detector (D2.2 R14.1), CLKB_clocking_fpga (IC5.58)
PD1_UP: CLKB_analog_phase_detector (D2.1 R8.2), CLKB_clocking_fpga (IC5.59)
PDADC0_CS: CLKB_analog_phase_detector (IC2.6), CLKB_clocking_fpga (IC5.65)
PDADC0_SCLK: CLKB_analog_phase_detector (IC2.4), CLKB_clocking_fpga (IC5.60)
PDADC0_SDO: CLKB_analog_phase_detector (IC2.5), CLKB_clocking_fpga (IC5.64)
PDADC1_CS: CLKB_analog_phase_detector (IC4.6), CLKB_clocking_fpga (IC5.68)
PDADC1_SCLK: CLKB_analog_phase_detector (IC4.4), CLKB_clocking_fpga (IC5.66)
PDADC1_SDO: CLKB_analog_phase_detector (IC4.5), CLKB_clocking_fpga (IC5.67)
PPS_IN_EXT: CLKB_main (CN1.35), CLKB_clocking_system (R26.2), CLKB_clocking_fpga (IC5.85)
PPS_OUT_SYNC: CLKB_main (CN1.37), CLKB_clocking_system (IC8.5), CLKB_clocking_fpga (IC5.86)
REFCLK1+: CLKB_main (CN3.4), CLKB_clocking_system (IC6.19)
REFCLK1-: CLKB_main (CN3.6), CLKB_clocking_system (IC6.18)
REFCLK_EXT_FB+: CLKB_clocking_system (IC7.7), CLKB_clocking_fpga (IC5.22 R17.2)
REFCLK_EXT_FB-: CLKB_clocking_system (IC7.8), CLKB_clocking_fpga (IC5.23 R17.1)
REFCLK_EXT_SEL: CLKB_clocking_system (IC7.15), CLKB_clocking_fpga (IC5.2)
REFCLK_FB+: CLKB_clocking_system (IC6.38), CLKB_clocking_fpga (IC5.88 R19.1)
REFCLK_FB-: CLKB_clocking_system (IC6.37), CLKB_clocking_fpga (IC5.89 R19.2)
REFCLK_MAIN+: CLKB_main (CN3.3), CLKB_clocking_system (IC6.17)
REFCLK_MAIN-: CLKB_main (CN3.5), CLKB_clocking_system (IC6.16)
REFCLK_VCSO_SEL: CLKB_clocking_system (IC6.42), CLKB_clocking_fpga (IC5.53)
RS_CTS: CLKB_main (CN1.41), CLKB_RS232_port (IC26.9)
RS_RTS: CLKB_main (CN1.43), CLKB_RS232_port (IC26.10)
RS_RXD: CLKB_main (CN1.42), CLKB_RS232_port (IC26.12)
RS_TXD: CLKB_main (CN1.44), CLKB_RS232_port (IC26.11)
SCL: CLKB_clocking_fpga (IC5.73 R16.1), CLKB_temp_sensors (IC39.1 IC40.1 IC41.1 IC42.1)
SDA: CLKB_clocking_fpga (IC5.74 R15.1), CLKB_temp_sensors (IC39.6 IC40.6 IC41.6 IC42.6)
TDO: CLKB_main (R55.2), CLKB_clocking_fpga (IC5.20)
UP0_ENABLE: CLKB_main (CN3.43), CLKB_clocking_fpga (IC5.98)
UP0_LOS: CLKB_main (CN1.28), CLKB_clocking_fpga (IC5.83)
UP0_RBCLK: CLKB_main (R57.2), CLKB_clocking_fpga (IC5.91 R59.1 R61.2)
UP0_SYNC: CLKB_main (CN3.50), CLKB_clocking_fpga (IC5.129)
UP0_SYNCEN: CLKB_main (CN3.45), CLKB_clocking_fpga (IC5.128)
UP1_ENABLE: CLKB_main (CN3.42), CLKB_clocking_fpga (IC5.101)
UP1_LOS: CLKB_main (CN1.14), CLKB_clocking_fpga (IC5.80)
UP1_RBCLK: CLKB_main (R58.2), CLKB_clocking_fpga (IC5.90 R60.1 R62.2)
UP1_SYNC: CLKB_main (CN3.44), CLKB_clocking_fpga (IC5.100)
UP1_SYNCEN: CLKB_main (CN3.46), CLKB_clocking_fpga (IC5.99)
WD_IN: CLKB_main (CN13.3), CLKB_clocking_fpga (IC5.84)
WD_OUT: CLKB_main (CN13.5), CLKB_clocking_fpga (IC5.87)